# EasyEDA Pro project ProProject_AceStacksRefac_2024-07-15.epro

# Schematic AcestacksV2
Create Date: 2024-04-24; Page Name: P1; Project Name: AceStacksRefac; Schematic Name: Schematic1_1; Update Date: 2024-05-28; Company: EasyEDA.com; Drawn: EasyEDA; Page Size: A4; Part Number: JLCPCB-002; Reviewed: EasyEDA; Version: V0.1
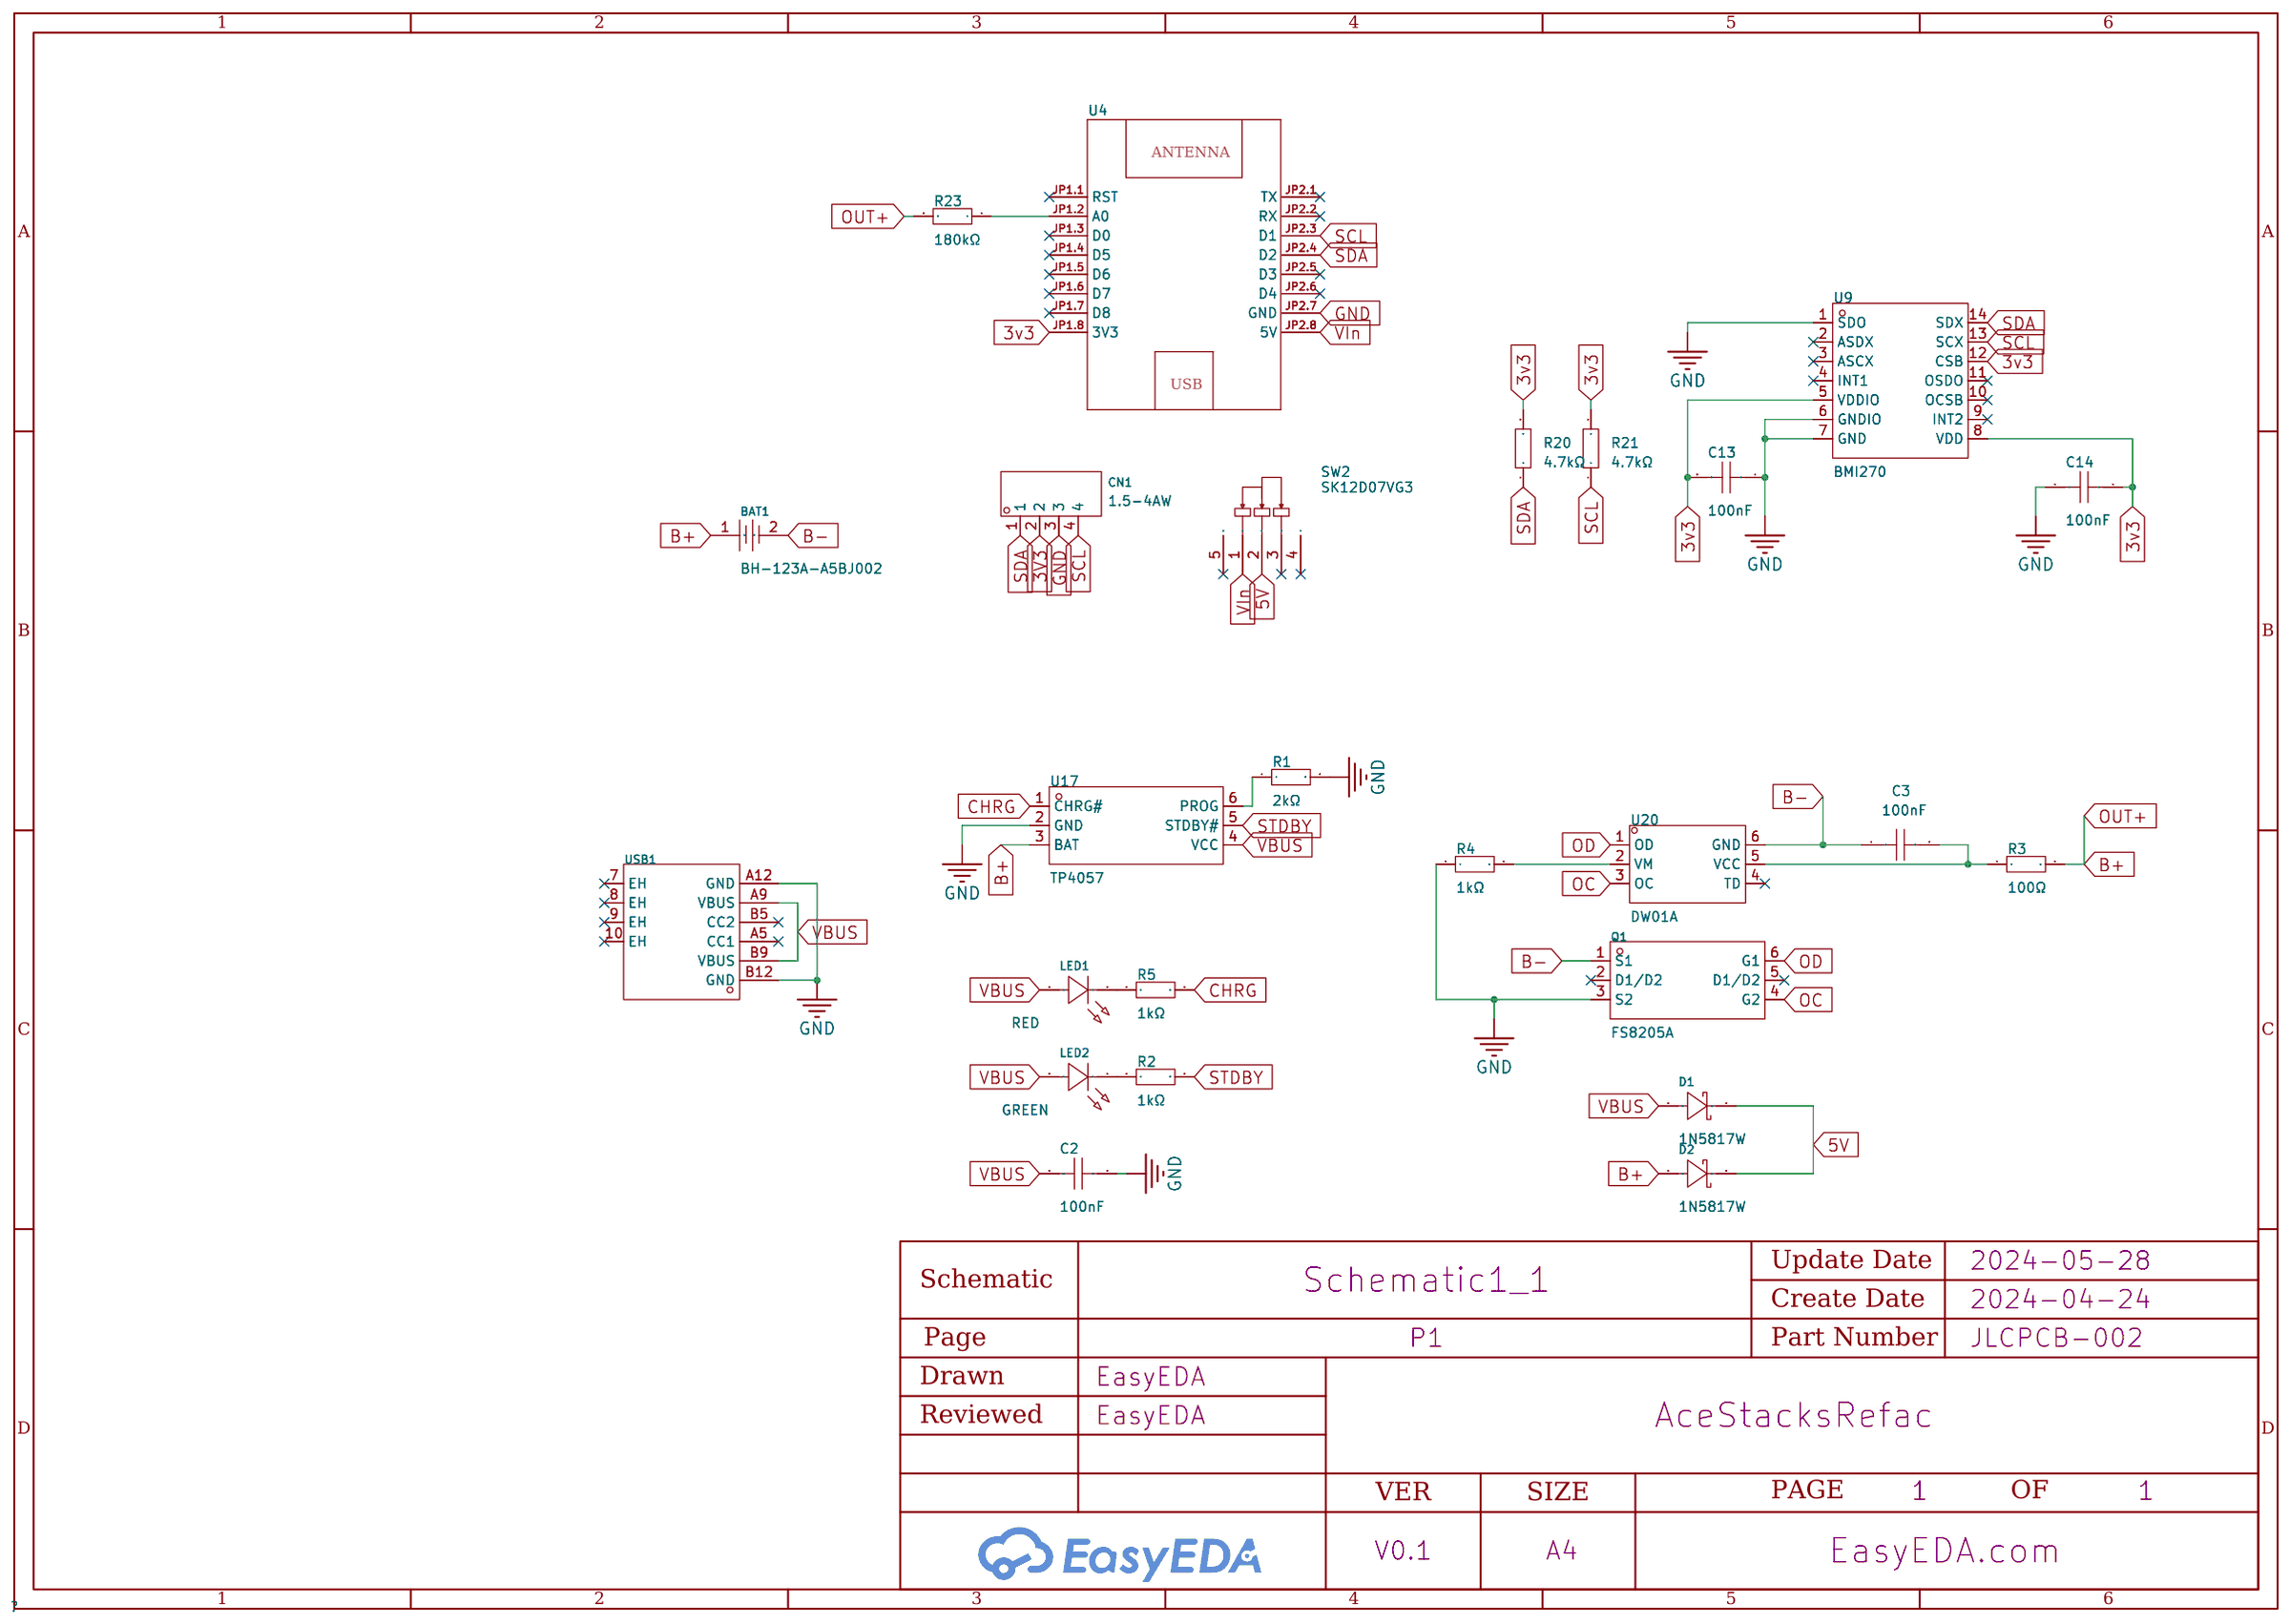
[diagram p0: schematic sheet]

## Parts
BAT1  BH-123A-A5BJ002  [BAT-TH_BH-123A-A5BJ002]
C2  100nF  [C0603]
C3  100nF  [C0603]
C13  100nF  [C0603]
C14  100nF  [C0603]
CN1  1.5-4AW  [CONN-TH_4P-P1.50_ZH1.5-4AW]
D1  1N5817W  [SOD-123_L2.8-W1.8-LS3.7-RD]
D2  1N5817W  [SOD-123_L2.8-W1.8-LS3.7-RD]
LED1  RED  [LED0603-RD_RED]
LED2  GREEN  [LED0603-RD_GREEN]
Q1  FS8205A  [SOT-23-6_L2.9-W1.6-P0.95-LS2.8-BR]
R1  2kΩ  [R0603]
R2  1kΩ  [R0603]
R3  100Ω  [R0603]
R4  1kΩ  [R0603]
R5  1kΩ  [R0603]
R20  4.7kΩ  [R0603]
R21  4.7kΩ  [R0603]
R23  180kΩ  [R0603]
SW2  SK12D07VG3  [SW-TH_SK12D07VG3]
U4  -  [D1-MINI]
U9  BMI270  [LGA-14_L3.0-W2.5-P0.50-BR]
U17  TP4057  [SOT-23-6_L2.9-W1.6-P0.95-LS2.8-BR]
U20  DW01A  [SOT-23-6_L2.9-W1.6-P0.95-LS2.8-BL]
USB1  -  [USB-SMD_U262-061N-4BVC11]

## Library data of the parts
BAT1 = BH-123A-A5BJ002: Connector Type:Battery case Battery Type:CR123A; LCSC Part Name: 电池盒 适用电池:CR123A; Supplier Part: C5290177; Manufacturer: MYOUNG(美阳); JLCPCB Part Class: Extended Part; Datasheet: https://atta.szlcsc.com/upload/public/pdf/source/20221129/C5DF5AE490C9EB9192DFF104AFD36393.pdf; Supplier: LCSC; Connector Type: Battery case; Battery Type: CR123A
C2 C3 C13 C14 = CC0603KRX7R9BB104: Capacitance: Tolerance:±10% Tolerance:±10% Voltage Rated: Temperature Coefficient:; LCSC Part Name: 100nF ±10% 50V; Supplier Part: C14663; Manufacturer: YAGEO(国巨); Supplier Footprint: 0603; JLCPCB Part Class: Basic Part; Datasheet: https://atta.szlcsc.com/upload/public/pdf/source/20180910/C282072_33301C7F631E79921B82A8DAC6BCC5B3.pdf; Supplier: LCSC; Tolerance: ±10%
CN1 = 1.5-4AW_C146006: Pins Structure:1x4P Pitch:1.5mm Mounting Style:Right-Angle Reference Series:ZH Number of Pins:4P Number of Rows:1 Number of PINs Per Row:4 Row Spacing:- Contact Material:-; LCSC Part Name: 1x4P 间距:1.5mm 弯插 系列:ZH; Supplier Part: C146006; Manufacturer: BOOMELE(博穆精密); Supplier Footprint: 弯插,P=1.5mm; JLCPCB Part Class: Extended Part; Datasheet: https://atta.szlcsc.com/upload/public/pdf/source/20180813/C192616_78C4F847BE402CBC7201CF3E488B4D25.pdf; Supplier: LCSC; Pins Structure: 1x4P; Pitch: 1.5mm; Mounting Style: Right-Angle; Reference Series: ZH; Number of Pins: 4P; Number of Rows: 1; Number of PINs Per Row: 4
D1 D2 = 1N5817W: Diode Configuration:Single Forward Voltage (Vf@If):750mV@3A Reverse Voltage (Vr):20V Average Rectified Current (Io):1A Reverse Leakage Current (Ir):1mA@20V; LCSC Part Name: 电压:20V 电流:1A; Supplier Part: C727113; Manufacturer: TWGMC(台湾迪嘉); Supplier Footprint: SOD-123; JLCPCB Part Class: Extended Part; Datasheet: https://atta.szlcsc.com/upload/public/pdf/source/20200828/C727113_260B72EC53C389C21DF1E8AB243F1BFC.pdf; Supplier: LCSC; Diode Configuration: Single; Forward Voltage (Vf@If): 750mV@3A; Reverse Voltage (Vr): 20V; Average Rectified Current (Io): 1A; Reverse Leakage Current (Ir): 1mA@20V
LED1 = XL-1608SURC-06: Emitted Color:Red Power Dissipation:55mW Forward Current:25mA Dominant Wavelength:617nm~621nm Dominant Wavelength:617nm~621nm Peak Wavelength:623nm Lens Color:无色透明透镜 Color Temperature:- Color Temperature:- Viewing Angle:120° Mounting Sytle:Positive post O; Supplier Part: C965799; Manufacturer: XINGLIGHT(成兴光); Supplier Footprint: 0603; JLCPCB Part Class: Extended Part; Datasheet: https://atta.szlcsc.com/upload/public/pdf/source/20221102/D860AFDD1CDB02C5A8064103A32707E2.pdf; Supplier: LCSC; Emitted Color: Red; Power Dissipation: 55mW; Forward Current: 25mA; Dominant Wavelength: 617nm~621nm; Peak Wavelength: 623nm; Lens Color: 无色透明透镜; Viewing Angle: 120°; Mounting Sytle: Positive post; Operating Temperature: -30℃~+85℃
LED2 = XL-1608UGC-04: Lamp Holder Type:- Emitted Color:Emerald Forward Voltage (VF):- Forward Voltage (VF):- Power Dissipation:80mW Forward Current:25mA Dominant Wavelength:516nm~525nm Dominant Wavelength:516nm~525nm Peak Wavelength:534nm Diode Configuration:独立二极管 Lens Color:无; Supplier Part: C965804; Manufacturer: XINGLIGHT(成兴光); Supplier Footprint: 0603; JLCPCB Part Class: Extended Part; Datasheet: https://atta.szlcsc.com/upload/public/pdf/source/20221102/520D6E465E5CFD1609C8A4DBC80D4018.pdf; Supplier: LCSC; Emitted Color: Emerald; Power Dissipation: 80mW; Forward Current: 25mA; Dominant Wavelength: 516nm~525nm; Peak Wavelength: 534nm; Diode Configuration: 独立二极管; Lens Color: 无色透明透镜; Viewing Angle: 120°; Mounting Sytle: Positive post; Operating Temperature: -30℃~+85℃
Q1 = FS8205A_C908265: Type:2 N-Channel Drain Source Voltage (Vdss): Continuous Drain Current (Id): Power Dissipation (Pd): Drain Source On Resistance (RDS(on)@Vgs,Id):18mΩ@4.5V,6A Gate Threshold Voltage (Vgs(th)@Id):1.2V@250uA Total Gate Charge (Qg@Vgs):11nC@4.5V Input Capacit; LCSC Part Name: 2个N沟道 耐压:20V 电流:6A; Supplier Part: C908265; Manufacturer: FUXINSEMI(富芯森美); Supplier Footprint: SOT-23-6L; JLCPCB Part Class: Extended Part; Datasheet: https://atta.szlcsc.com/upload/public/pdf/source/20201027/C908265_C6F1A5E0FB14735EF799FEF607A99450.pdf; Supplier: LCSC; Type: 2 N-Channel; Drain Source On Resistance (RDS(on)@Vgs,Id): 18mΩ@4.5V,6A; Gate Threshold Voltage (Vgs(th)@Id): 1.2V@250uA; Total Gate Charge (Qg@Vgs): 11nC@4.5V; Input Capacitance (Ciss@Vds): 800pF@8V; Reverse Transfer Capacitance (Crss@Vds): 125pF@8V; Operating Temperature: -55℃~+150℃@(Tj)
R1 = 0603WAF2001T5E: Type:Thick Film Resistors Resistance:2kΩ Tolerance:±1% Tolerance:±1% Power(Watts): Overload Voltage (Max): Temperature Coefficient:±100ppm/℃ Temperature Coefficient:±100ppm/℃ Operating Temperature Range:-55℃~+155℃ Operating Temperature Range:-55℃~+155℃; LCSC Part Name: 2kΩ ±1% 100mW 厚膜电阻; Supplier Part: C22975; Manufacturer: UNI-ROYAL(厚声); Supplier Footprint: 0603; JLCPCB Part Class: Basic Part; Datasheet: https://atta.szlcsc.com/upload/public/pdf/source/20200306/C422600_1E6D84923E4A46A82E41ADD87F860B5C.pdf; Supplier: LCSC; Type: Thick Film Resistors; Tolerance: ±1%; Temperature Coefficient: ±100ppm/℃; Operating Temperature Range: -55℃~+155℃
R2 R4 R5 = 0603WAF1001T5E: Type:Thick Film Resistors Resistance:1kΩ Tolerance:±1% Tolerance:±1% Power(Watts): Overload Voltage (Max): Temperature Coefficient:±100ppm/℃ Temperature Coefficient:±100ppm/℃ Operating Temperature Range:-55℃~+155℃ Operating Temperature Range:-55℃~+155℃; LCSC Part Name: 1kΩ ±1% 100mW 厚膜电阻; Supplier Part: C21190; Manufacturer: UNI-ROYAL(厚声); Supplier Footprint: 0603; JLCPCB Part Class: Basic Part; Datasheet: https://atta.szlcsc.com/upload/public/pdf/source/20200306/C422600_1E6D84923E4A46A82E41ADD87F860B5C.pdf; Supplier: LCSC; Type: Thick Film Resistors; Tolerance: ±1%; Temperature Coefficient: ±100ppm/℃; Operating Temperature Range: -55℃~+155℃
R3 = 0603WAF1000T5E: Type:Thick Film Resistors Resistance: Tolerance:±1% Tolerance:±1% Power(Watts): Overload Voltage (Max): Temperature Coefficient:±200ppm/℃ Temperature Coefficient:±200ppm/℃ Operating Temperature Range:-55℃~+155℃ Operating Temperature Range:-55℃~+155℃; LCSC Part Name: 100Ω ±1% 100mW 厚膜电阻; Supplier Part: C22775; Manufacturer: UNI-ROYAL(厚声); Supplier Footprint: 0603; JLCPCB Part Class: Basic Part; Datasheet: https://atta.szlcsc.com/upload/public/pdf/source/20200306/C422600_1E6D84923E4A46A82E41ADD87F860B5C.pdf; Supplier: LCSC; Type: Thick Film Resistors; Tolerance: ±1%; Temperature Coefficient: ±200ppm/℃; Operating Temperature Range: -55℃~+155℃
R20 R21 = 0603WAF4701T5E: Type:Thick Film Resistors Resistance:4.7kΩ Tolerance:±1% Tolerance:±1% Power(Watts): Overload Voltage (Max): Temperature Coefficient:±100ppm/℃ Temperature Coefficient:±100ppm/℃ Operating Temperature Range:-55℃~+155℃ Operating Temperature Range:-55℃~+155℃; LCSC Part Name: 4.7kΩ ±1% 100mW 厚膜电阻; Supplier Part: C23162; Manufacturer: UNI-ROYAL(厚声); Supplier Footprint: 0603; JLCPCB Part Class: Basic Part; Datasheet: https://atta.szlcsc.com/upload/public/pdf/source/20200306/C422600_1E6D84923E4A46A82E41ADD87F860B5C.pdf; Supplier: LCSC; Type: Thick Film Resistors; Tolerance: ±1%; Temperature Coefficient: ±100ppm/℃; Operating Temperature Range: -55℃~+155℃
R23 = RTT03184JTP: Type:Thick Film Resistors Resistance: Tolerance:±5% Tolerance:±5% Power(Watts): Overload Voltage (Max): Temperature Coefficient:±100ppm/℃ Temperature Coefficient:±100ppm/℃ Operating Temperature Range:-55℃~+155℃ Operating Temperature Range:-55℃~+155℃; LCSC Part Name: 厚膜电阻 180kΩ ±5% 100mW; Supplier Part: C103362; Manufacturer: RALEC(旺诠); Supplier Footprint: 0603; JLCPCB Part Class: Extended Part; Datasheet: https://atta.szlcsc.com/upload/public/pdf/source/20191219/C158410_884373A5B7E1BC76BF57BC45A946C093.pdf; Supplier: LCSC; Type: Thick Film Resistors; Tolerance: ±5%; Temperature Coefficient: ±100ppm/℃; Operating Temperature Range: -55℃~+155℃
SW2 = SK12D07VG3_C431547: Circuit:SPDT Actuator Style:- Pin Style:PCPin Switch Length:8.7mm Switch Width:4.4mm Switch Height:4.7mm Mounting Style:侧插 Actuator Color:- Current Rating (DC):500mA Voltage Rating (DC):50V Current Rating (AC):- Voltage Rating (AC):- Mechanical Life:5千次 O; LCSC Part Name: 两档位卧式拨动开关,柄长3MM; Supplier Part: C431547; Manufacturer: SHOU HAN(首韩); Supplier Footprint: 插件; JLCPCB Part Class: Extended Part; Datasheet: https://atta.szlcsc.com/upload/public/pdf/source/20190925/C431547_01B93C6F3FA5C09E15F8CCBF4E6DB91A.pdf; Supplier: LCSC; Circuit: SPDT; Pin Style: PCPin; Switch Length: 8.7mm; Switch Width: 4.4mm; Switch Height: 4.7mm; Mounting Style: 侧插; Current Rating (DC): 500mA; Voltage Rating (DC): 50V; Mechanical Life: 5千次; Operating Temperature: -10℃~+50℃
U4 = D1-MINI
U9 = BMI270: Supplier Part: C2836813; Manufacturer: Bosch(博世); Supplier Footprint: LGA-14(2.5x3); JLCPCB Part Class: Extended Part; Datasheet: https://atta.szlcsc.com/upload/public/pdf/source/20210625/C2836813_35E1F3F92097F45A3828DF13DDBA01A5.pdf; Supplier: LCSC
U17 = TP4057: Supply Voltage:6.5V Supply Voltage:6.5V Maximum Charge Current:500mA Type of Battery:锂离子/Polymer Number of Cells:1 Number of Cells:1 Operating Temperature:-40℃~+85℃ Operating Temperature:-40℃~+85℃; Supplier Part: C725791; Manufacturer: UMW(友台半导体); Supplier Footprint: SOT-23-6; JLCPCB Part Class: Extended Part; Datasheet: https://atta.szlcsc.com/upload/public/pdf/source/20231109/7FB39B0490CD1514A6792371FCA0BB30.pdf; Supplier: LCSC; Supply Voltage: 6.5V; Maximum Charge Current: 500mA; Type of Battery: 锂离子/Polymer; Number of Cells: 1; Operating Temperature: -40℃~+85℃
U20 = DW01A_C351410: Supplier Part: C351410; Manufacturer: PUOLOP(迪浦); Supplier Footprint: SOT-23-6L; JLCPCB Part Class: Extended Part; Datasheet: https://atta.szlcsc.com/upload/public/pdf/source/20190109/C351410_3E9B9491D1909DF24C48D1B9CD871392.pdf; Supplier: LCSC
USB1 = USB_ TYPE-C-6P: Supplier Footprint: Through

## Nets
3v3: C13.2 C14.1 R20.2 R21.2 U4.JP1.8(3V3) U9.5(VDDIO) U9.8(VDD) U9.12(CSB)
3V3: CN1.2
5V: D1.1(C) D2.1(C) SW2.2
GND: C2.1 C13.1 C14.2 CN1.3 Q1.3(S2) R1.2 R4.1 U4.JP2.7(GND) U9.1(SDO) U9.6(GNDIO) U9.7(GND) U17.2(GND) USB1.A12(GND) USB1.B12(GND)
VBUS: C2.2 D1.2(A) LED1.2(A) LED2.2(A) U17.4(VCC) USB1.A9(VBUS) USB1.B9(VBUS)
VIn: SW2.1 U4.JP2.8(5V)
B+: BAT1.1 D2.2(A) R3.2 R23.2 U17.3(BAT)
B-: BAT1.2 C3.1 Q1.1(S1) U20.6(GND)
CHRG: R5.2 U17.1(CHRG#)
OC: Q1.4(G2) U20.3(OC)
OD: Q1.6(G1) U20.1(OD)
SCL: CN1.4 R21.1 U4.JP2.3(D1) U9.13(SCX)
SDA: CN1.1 R20.1 U4.JP2.4(D2) U9.14(SDX)
STDBY: R2.2 U17.5(STDBY#)
$1N2268: C3.2 R3.1 U20.5(VCC)
$1N2333: R1.1 U17.6(PROG)
$1N2700: R4.2 U20.2(VM)
$1N5453: R23.1 U4.JP1.2(A0)
$1N16863: LED1.1(K) R5.1
$1N16996: LED2.1(K) R2.1

Not connected (* = marked no-connect by the designer): Q1 2(D1/D2)* 5(D1/D2)*; SW2 3* 4* 5*; U4 JP1.1(RST)* JP1.3(D0)* JP1.4(D5)* JP1.5(D6)* JP1.6(D7)* JP1.7(D8)* JP2.1(TX)* JP2.2(RX)* JP2.5(D3)* JP2.6(D4)*; U9 2(ASDX)* 3(ASCX)* 4(INT1)* 9(INT2)* 10(OCSB)* 11(OSDO)*; U20 4(TD)*; USB1 7(EH)* 8(EH)* 9(EH)* 10(EH)* A5(CC1)* B5(CC2)*

# Schematic Schematic3
Create Date: 2024-05-04; Page Name: P1; Project Name: AceStacksRefac; Schematic Name: Schematic3; Update Date: 2024-05-28; Company: EasyEDA.com; Drawn: EasyEDA; Page Size: A4; Part Number: JLCPCB-002; Reviewed: EasyEDA; Version: V0.1
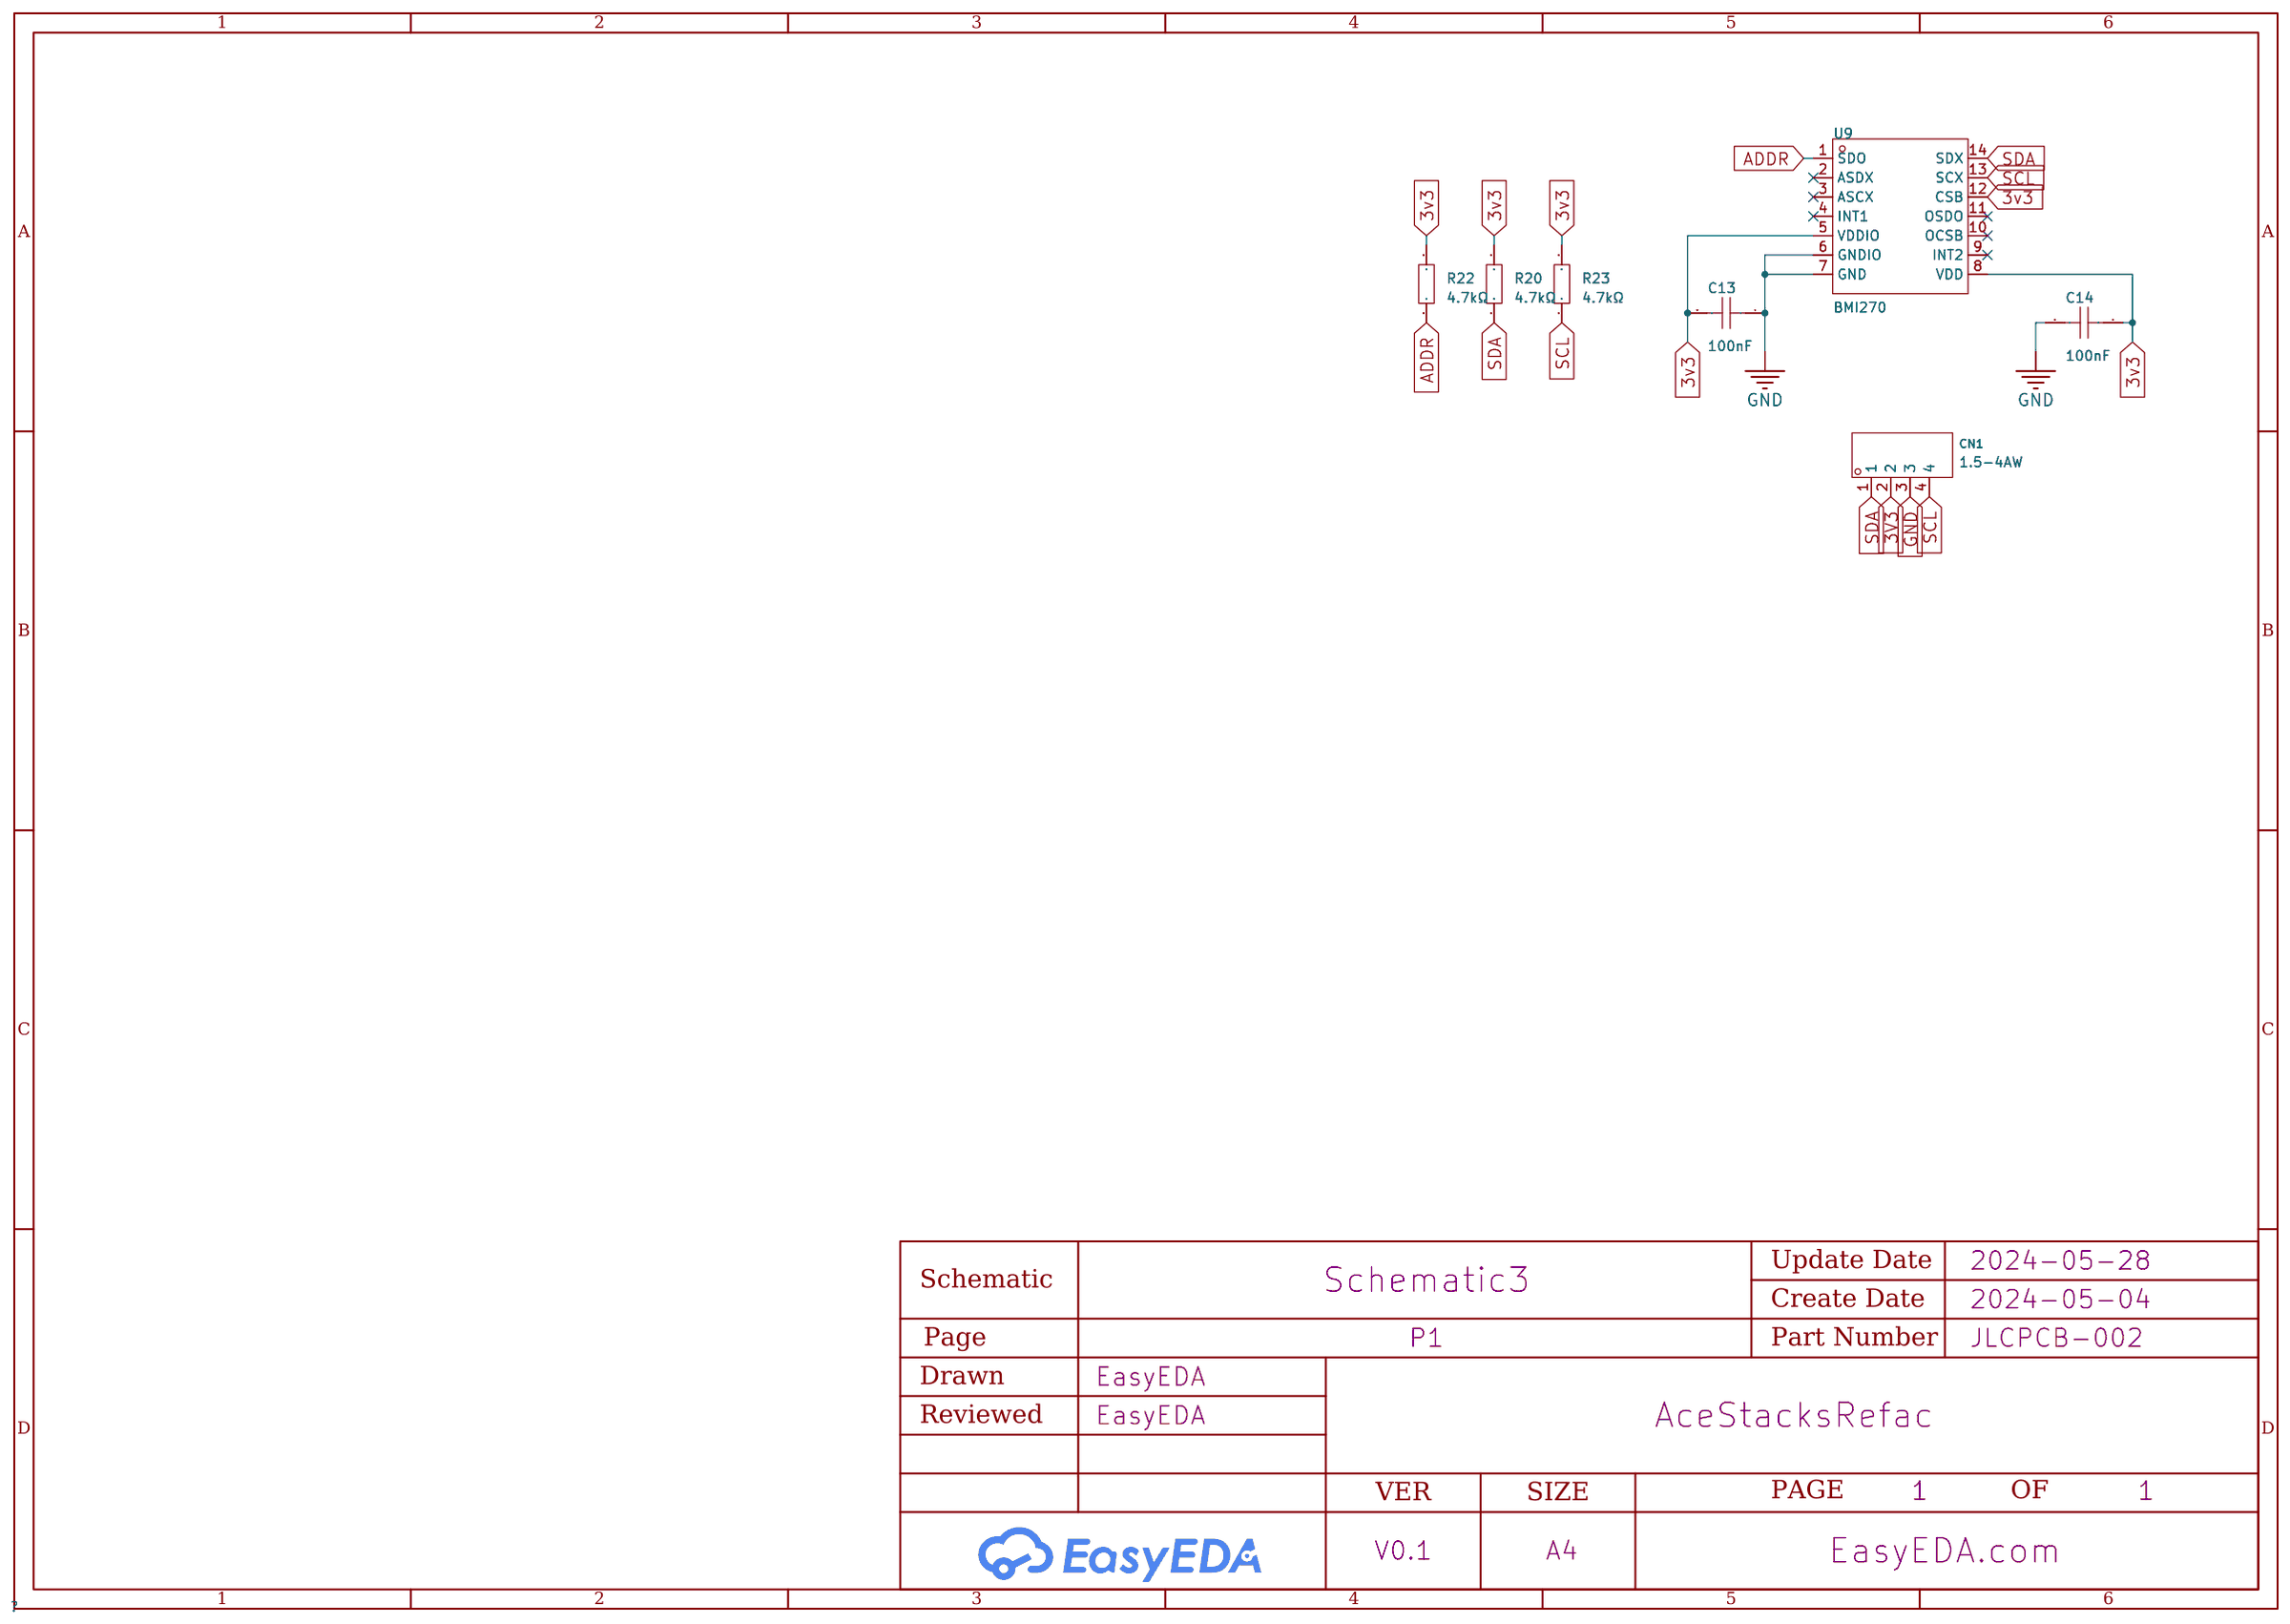
[diagram p1: schematic sheet]

## Parts
C13  100nF  [C0603]
C14  100nF  [C0603]
CN1  1.5-4AW  [CONN-TH_4P-P1.50_ZH1.5-4AW]
R20  4.7kΩ  [R0603]
R22  4.7kΩ  [R0603]
R23  4.7kΩ  [R0603]
U9  BMI270  [LGA-14_L3.0-W2.5-P0.50-BR]

## Library data of the parts
C13 C14 = CC0603KRX7R9BB104: Capacitance: Tolerance:±10% Tolerance:±10% Voltage Rated: Temperature Coefficient:; LCSC Part Name: 100nF ±10% 50V; Supplier Part: C14663; Manufacturer: YAGEO(国巨); Supplier Footprint: 0603; JLCPCB Part Class: Basic Part; Datasheet: https://atta.szlcsc.com/upload/public/pdf/source/20180910/C282072_33301C7F631E79921B82A8DAC6BCC5B3.pdf; Supplier: LCSC; Tolerance: ±10%
CN1 = 1.5-4AW_C146006: Pins Structure:1x4P Pitch:1.5mm Mounting Style:Right-Angle Reference Series:ZH Number of Pins:4P Number of Rows:1 Number of PINs Per Row:4 Row Spacing:- Contact Material:-; LCSC Part Name: 1x4P 间距:1.5mm 弯插 系列:ZH; Supplier Part: C146006; Manufacturer: BOOMELE(博穆精密); Supplier Footprint: 弯插,P=1.5mm; JLCPCB Part Class: Extended Part; Datasheet: https://atta.szlcsc.com/upload/public/pdf/source/20180813/C192616_78C4F847BE402CBC7201CF3E488B4D25.pdf; Supplier: LCSC; Pins Structure: 1x4P; Pitch: 1.5mm; Mounting Style: Right-Angle; Reference Series: ZH; Number of Pins: 4P; Number of Rows: 1; Number of PINs Per Row: 4
R20 R22 R23 = 0603WAF4701T5E: Type:Thick Film Resistors Resistance:4.7kΩ Tolerance:±1% Tolerance:±1% Power(Watts): Overload Voltage (Max): Temperature Coefficient:±100ppm/℃ Temperature Coefficient:±100ppm/℃ Operating Temperature Range:-55℃~+155℃ Operating Temperature Range:-55℃~+155℃; LCSC Part Name: 4.7kΩ ±1% 100mW 厚膜电阻; Supplier Part: C23162; Manufacturer: UNI-ROYAL(厚声); Supplier Footprint: 0603; JLCPCB Part Class: Basic Part; Datasheet: https://atta.szlcsc.com/upload/public/pdf/source/20200306/C422600_1E6D84923E4A46A82E41ADD87F860B5C.pdf; Supplier: LCSC; Type: Thick Film Resistors; Tolerance: ±1%; Temperature Coefficient: ±100ppm/℃; Operating Temperature Range: -55℃~+155℃
U9 = BMI270: Supplier Part: C2836813; Manufacturer: Bosch(博世); Supplier Footprint: LGA-14(2.5x3); JLCPCB Part Class: Extended Part; Datasheet: https://atta.szlcsc.com/upload/public/pdf/source/20210625/C2836813_35E1F3F92097F45A3828DF13DDBA01A5.pdf; Supplier: LCSC

## Nets
3v3: C13.2 C14.1 R20.2 R22.2 R23.2 U9.5(VDDIO) U9.8(VDD) U9.12(CSB)
3V3: CN1.2
GND: C13.1 C14.2 CN1.3 U9.6(GNDIO) U9.7(GND)
ADDR: R22.1 U9.1(SDO)
SCL: CN1.4 R23.1 U9.13(SCX)
SDA: CN1.1 R20.1 U9.14(SDX)

Not connected (* = marked no-connect by the designer): U9 2(ASDX)* 3(ASCX)* 4(INT1)* 9(INT2)* 10(OCSB)* 11(OSDO)*

# Board PCB12
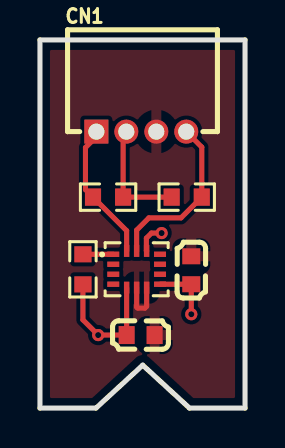
[diagram p2: board, top side]
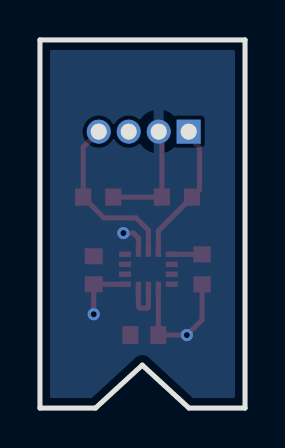
[diagram p3: board, bottom side, seen from below]

Outline 10.26 x 18.44 mm; copper layers: Top Layer, Bottom Layer. Coordinates in mm from the lower left corner of the outline.
Outline path: 0,18.44 0,0 2.8,0 5.14,2.15 7.48,0 10.26,0 10.26,18.44 0,18.44
Stack: Top Layer 0.035mm / Dielectric1 1.51mm FR4 er 4.5 / Bottom Layer 0.035mm

## Design rules (mm)
template: JLCPCB Capability(Two Layers Board)
spacing copperThickness1oz (default): track to track 0.102, other pairs 0.152 to 0.3
spacing copperThickness2oz: track to track 0.203, other pairs 0.152 to 0.3
track width copperThickness1oz (default): min 0.127, default 0.254, max 2.54
track width copperThickness2oz: min 0.203, default 0.254, max 2.54
differential pair differentialPair (default): width min 0.127, default 0.254, max 2.54; gap min 0.152, default 0.152
via viaSize (default): diameter min 0.5, default 0.61, max 10; hole min 0.3, default 0.305, max 6.3

## Placement (name value [footprint] x y rotation side)
C13  100nF  [C0603]  7.57 6.9 270 top
C14  100nF  [C0603]  5.04 3.66 0 top
CN1  1.5-4AW  [CONN-TH_4P-P1.50_ZH1.5-4AW]  5.07 13.84 0 top
R20  4.7kΩ  [R0603]  3.41 10.56 0 top
R22  4.7kΩ  [R0603]  2.15 6.95 270 top
R23  4.7kΩ  [R0603]  7.34 10.56 180 top
U9  BMI270  [LGA-14_L3.0-W2.5-P0.50-BR]  4.84 6.95 180 top

## Footprints (pads in the part's own frame, mm; a bottom-side part is the same pattern mirrored in y, then rotated)
C0603
  rect 0.8x0.9 smd: 1(-0.7,0) 2(0.7,0)
CONN-TH_4P-P1.50_ZH1.5-4AW
  rect 1.2x1.2 hole 0.8: 1(-2.25,0)
  round 1.2 hole 0.8: 2(-0.75,0) 3(0.751,0) 4(2.25,0)
LGA-14_L3.0-W2.5-P0.50-BR
  rect 0.6x0.27 smd: 1(1.17,-0.75) 2(1.17,-0.25) 3(1.17,0.25) 4(1.17,0.75) 8(-1.17,0.75) 9(-1.17,0.25) 10(-1.17,-0.25) 11(-1.17,-0.75)
  rect 0.27x0.6 smd: 5(0.5,0.92) 6(0,0.92) 7(-0.5,0.92) 12(-0.5,-0.92) 13(0,-0.92) 14(0.5,-0.92)
R0603
  rect 0.806x0.864 smd: 1(-0.753,0) 2(0.753,0)

## Nets
As in the schematic, except:
3V3: C13.2 C14.1 CN1.2 R20.2 R22.2 R23.2 U9.5 U9.8 U9.12

Pads without a net: U9 2 3 4 9 10 11

## Via types
v1: diameter 0.61, hole 0.305, Top Layer to Bottom Layer, 3 vias

## Routing (per net, layer and track width the routed paths; a pad name or vN(x,y) marks a point on that pad's centre or on a via; arc(x,y) is an arc through that point)
3V3: length 17
  Top Layer w0.254: U9.12 5.33,7.88 5.33,8.51 5.58,8.76 v1(6.09,8.76) ; U9.5 C14.1 v1(2.91,3.66) 2.15,4.42 R22.2 ; CN1.2 4.16,13.68 R20.2 R23.2 ; v1(7.57,4.7) C13.2 U9.8
GND: length 2.5
  Top Layer w0.254: U9.7 5.34,5.09 5.25,5.01 4.89,5.01 4.84,5.06 U9.6
ADDR: length 1.5
  Top Layer w0.254: U9.1 R22.1
SCL: length 8.6
  Top Layer w0.254: U9.13 4.84,8.91 5.45,9.52 7.06,9.52 R23.1 8.1,13.07 CN1.4
SDA: length 7.2
  Top Layer w0.254: 3.08,13.84 2.28,13.05 2.28,10.94 R20.1 4.34,8.88 U9.14

## Copper pours and planes (outline as drawn; the poured copper is in the pictures)
3V3 on Bottom Layer: -2.42,20.45 13.45,20.45 13.45,-3.81 -2.42,-3.81
GND on Top Layer: 11.68,-1.91 -1.28,-1.91 -1.28,20.07 11.68,20.07

# Board PCB1_1
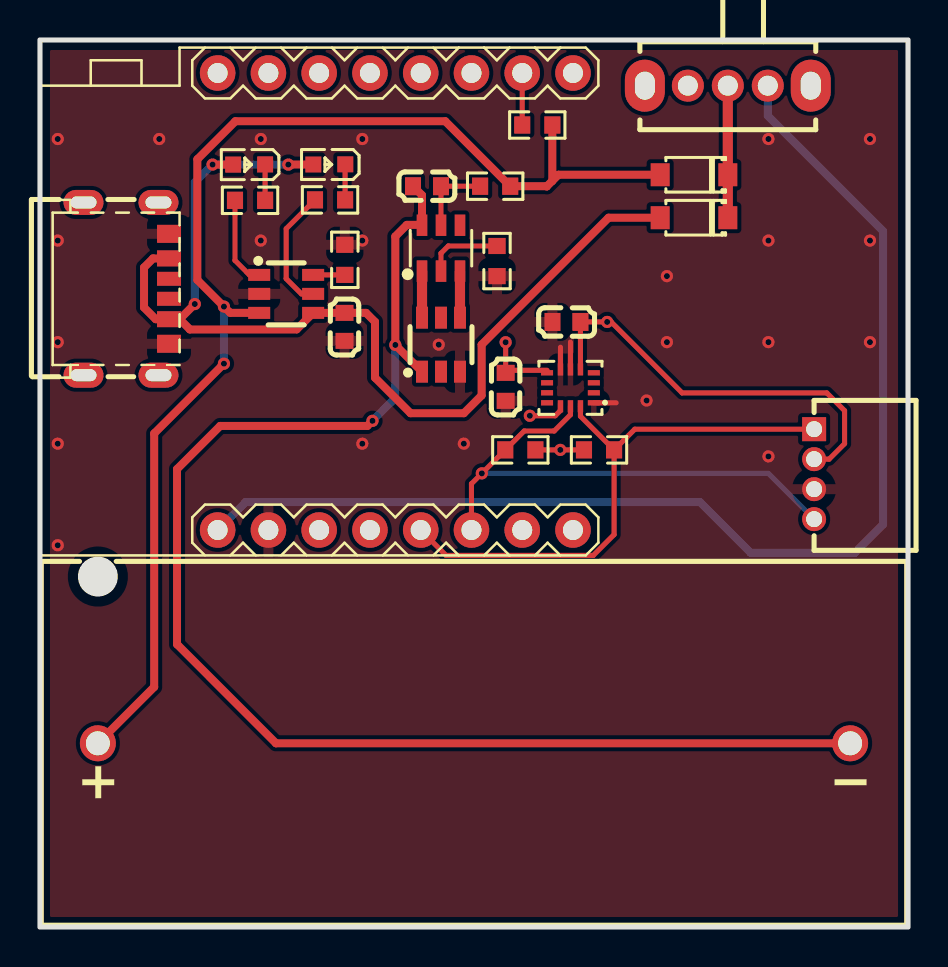
[diagram p4: board, top side]
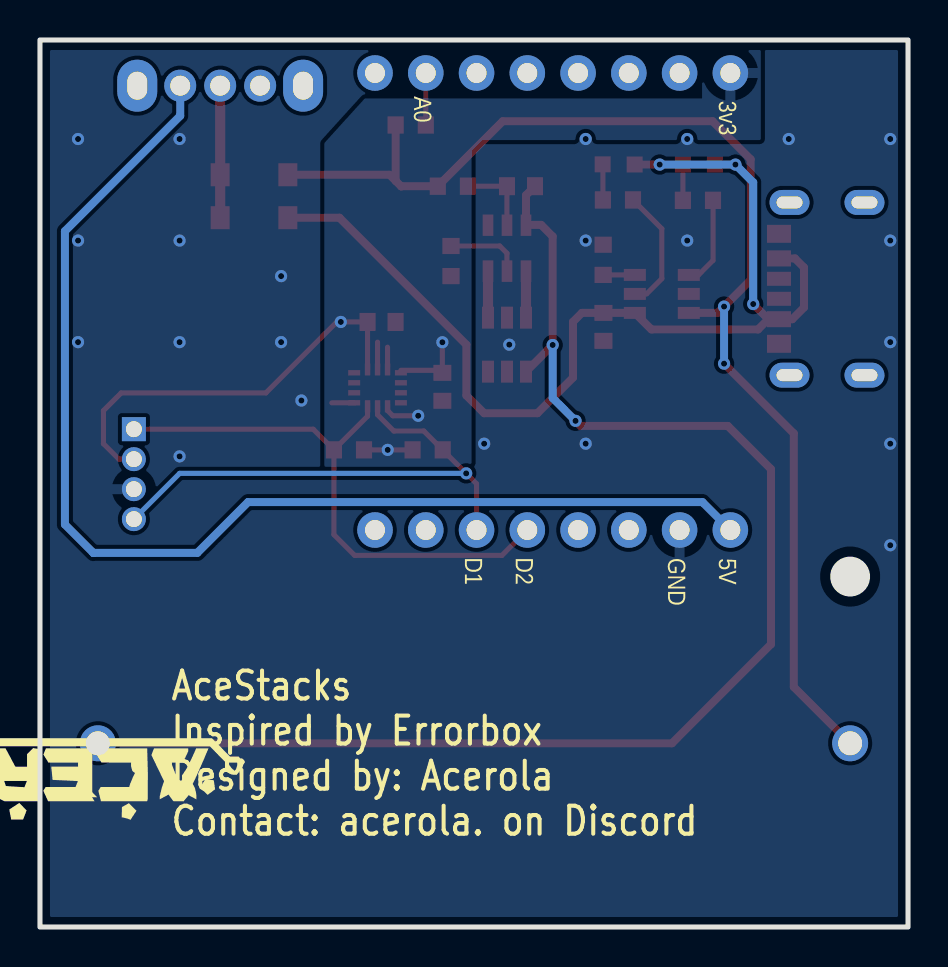
[diagram p5: board, bottom side, seen from below]

Outline 43.43 x 44.37 mm; copper layers: Top Layer, Bottom Layer. Coordinates in mm from the lower left corner of the outline.
Outline path: rectangle 0,44.37 43.43,0
Stack: Top Layer 0.035mm / Dielectric1 1.51mm FR4 er 4.5 / Bottom Layer 0.035mm

## Design rules (mm)
template: Custom Config
spacing copperThickness1oz (default): track to track 0.102, other pairs 0.152 to 0.3
spacing copperThickness2oz: track to track 0.203, other pairs 0.152 to 0.3
track width copperThickness1oz (default): min 0.127, default 0.254, max 2.54
track width copperThickness2oz: min 0.203, default 0.254, max 2.54
differential pair differentialPair (default): width min 0.127, default 0.254, max 2.54; gap min 0.152, default 0.152
via viaSize (default): diameter min 0.5, default 0.61, max 10; hole min 0.3, default 0.305, max 6.299

## Placement (name value [footprint] x y rotation side)
BAT1  BH-123A-A5BJ002  [BAT-TH_BH-123A-A5BJ002]  21.72 9.19 0 top
C2  100nF  [C0603]  15.24 30.02 90 top
C3  100nF  [C0603]  19.37 37.05 0 top
C13  100nF  [C0603]  23.3 27.02 90 top
C14  100nF  [C0603]  26.34 30.27 180 top
CN1  1.5-4AW  [CONN-TH_4P-P1.50_ZH1.5-4AW]  38.73 22.65 270 top
D1  1N5817W  [SOD-123_L2.8-W1.8-LS3.7-RD]  32.72 35.48 180 top
D2  1N5817W  [SOD-123_L2.8-W1.8-LS3.7-RD]  32.72 37.63 180 top
LED1  RED  [LED0603-RD_RED]  10.47 38.14 180 top
LED2  GREEN  [LED0603-RD_GREEN]  14.48 38.15 180 top
Q1  FS8205A  [SOT-23-6_L2.9-W1.6-P0.95-LS2.8-BR]  20.07 29.13 270 top
R1  2kΩ  [R0603]  15.25 33.37 90 top
R2  1kΩ  [R0603]  14.51 36.37 180 top
R3  100Ω  [R0603]  22.78 37.05 0 top
R4  1kΩ  [R0603]  22.87 33.31 90 top
R5  1kΩ  [R0603]  10.51 36.35 180 top
R20  4.7kΩ  [R0603]  27.97 23.87 180 top
R21  4.7kΩ  [R0603]  24.04 23.87 0 top
R23  180kΩ  [R0603]  24.88 40.12 0 top
SW2  SK12D07VG3  [SW-TH_SK12D07VG3]  34.42 42.08 180 top
U4  -  [D1-MINI]  0 43.99 270 top
U9  BMI270  [LGA-14_L3.0-W2.5-P0.50-BR]  26.54 26.97 0 top
U17  TP4057  [SOT-23-6_L2.9-W1.6-P0.95-LS2.8-BR]  12.32 31.67 180 top
U20  DW01A  [SOT-23-6_L2.9-W1.6-P0.95-LS2.8-BL]  20.07 33.95 0 top
USB1  -  [USB-SMD_U262-061N-4BVC11]  4.32 31.92 270 top

## Footprints (pads in the part's own frame, mm; a bottom-side part is the same pattern mirrored in y, then rotated)
BAT-TH_BH-123A-A5BJ002
  round 1.8 hole 1.2: 1(-18.82,0) 2(18.82,0)
C0603
  rect 0.8x0.9 smd: 1(-0.7,0) 2(0.7,0)
CONN-TH_4P-P1.50_ZH1.5-4AW
  rect 1.2x1.2 hole 0.8: 1(-2.25,0)
  round 1.2 hole 0.8: 2(-0.75,0) 3(0.751,0) 4(2.25,0)
D1-MINI
  round 1.778 hole 1.001x1: JP1.1(1.27,26.67) JP1.2(1.27,24.13) JP1.3(1.27,21.59) JP1.4(1.27,19.05) JP1.5(1.27,16.51) JP1.6(1.27,13.97) JP1.7(1.27,11.43) JP1.8(1.27,8.89)
  round 1.778 hole 1x1: JP2.1(24.13,26.67) JP2.2(24.13,24.13) JP2.3(24.13,21.59) JP2.4(24.13,19.05) JP2.5(24.13,16.51) JP2.6(24.13,13.97) JP2.7(24.13,11.43) JP2.8(24.13,8.89)
LED0603-RD_GREEN
  rect 0.8x0.8 smd: 1(-0.799,-0.004) 2(0.799,0.004)
LED0603-RD_RED
  rect 0.8x0.8 smd: 1(-0.799,-0.004) 2(0.799,0.004)
LGA-14_L3.0-W2.5-P0.50-BR
  rect 0.6x0.27 smd: 1(1.17,-0.75) 2(1.17,-0.25) 3(1.17,0.25) 4(1.17,0.75) 8(-1.17,0.75) 9(-1.17,0.25) 10(-1.17,-0.25) 11(-1.17,-0.75)
  rect 0.27x0.6 smd: 5(0.5,0.92) 6(0,0.92) 7(-0.5,0.92) 12(-0.5,-0.92) 13(0,-0.92) 14(0.5,-0.92)
R0603
  rect 0.806x0.864 smd: 1(-0.753,0) 2(0.753,0)
SOD-123_L2.8-W1.8-LS3.7-RD
  rect 0.95x1.15 smd: 1(-1.692,0) 2(1.692,0)
SOT-23-6_L2.9-W1.6-P0.95-LS2.8-BL
  rect 0.532x1.072 smd: 1(-0.95,-1.149) 2(0,-1.149) 3(0.95,-1.149) 4(0.95,1.149) 5(0,1.149) 6(-0.95,1.149)
SOT-23-6_L2.9-W1.6-P0.95-LS2.8-BR
  rect 1.1x0.6 smd: 1(1.35,-0.95) 2(1.35,0) 3(1.35,0.95) 4(-1.35,0.95) 5(-1.35,0) 6(-1.35,-0.95)
SW-TH_SK12D07VG3
  oval 1.6x1.6 hole 1: 1(-2,0) 2(0,0) 3(2,0)
  oval 2x2.6 hole 1x1.4: 4(4.15,0) 5(-4.15,0)
USB-SMD_U262-061N-4BVC11
  oval 1.25x2 hole 0.6x1.3: 7(-4.32,1.611) 8(4.32,1.611) 9(-4.32,-2.139) 10(4.32,-2.139)
  rect 0.7x1.2 smd: A5(-0.5,2.139) B5(0.5,2.139)
  rect 0.8x1.2 smd: A9(1.52,2.139) B9(-1.52,2.139)
  rect 0.9x1.2 smd: A12(2.75,2.139) B12(-2.75,2.139)

## Nets
As in the schematic, except:
3V3: C13.2 C14.1 CN1.2 R20.2 R21.2 U4.JP1.8 U9.5 U9.8 U9.12
VIN: SW2.1 U4.JP2.8
OUT+: BAT1.1 D2.2 R3.2 R23.2 U17.3

Pads without a net: Q1 2 5; SW2 3 4 5; U4 JP1.1 JP1.3 JP1.4 JP1.5 JP1.6 JP1.7 JP2.1 JP2.2 JP2.5 JP2.6; U9 2 3 4 9 10 11; U20 4; USB1 7 8 9 10 A5 B5

## Via types
v1: diameter 0.61, hole 0.305, Top Layer to Bottom Layer, 35 vias

## Routing (per net, layer and track width the routed paths; a pad name or vN(x,y) marks a point on that pad's centre or on a via; arc(x,y) is an arc through that point)
3V3: length 28.8
  Top Layer w0.254: v1(23.3,29.25) 23.3,27.85 25.37,27.85 ; U9.5 C14.1 v1(28.38,30.27) 28.58,30.27 32.13,26.72 39.37,26.72 40.26,25.83 40.26,24.18 39.48,23.4 CN1.2 ; 26.04,26.18 26.04,25.83 25.78,25.57 v1(24.51,25.57) ; R20.2 v1(26.03,23.87) R21.2
5V: length 6.6
  Top Layer w0.508: D1.1 D2.1 SW2.2
GND: length 3.3
  Top Layer w0.254: 26.54,28.02 26.54,29.26 ; 26.04,28.02 26.04,29 ; U9.1 28.83,26.22
  vias: v1(0.89,39.42) v1(0.89,34.34) v1(0.89,29.26) v1(0.89,24.18) v1(0.89,19.1) v1(5.97,39.42) v1(11.05,39.42) v1(11.05,34.34) v1(16.13,39.42) v1(16.13,34.34) v1(16.13,24.18) v1(19.95,29.13) v1(21.21,24.18) v1(30.35,26.33) v1(31.37,32.56) v1(31.37,29.26) v1(36.45,39.42) v1(36.45,34.34) v1(36.45,29.26) v1(36.45,23.54) v1(41.53,39.42) v1(41.53,34.34) v1(41.53,29.26)
VBUS: length 53.7
  Top Layer w0.399: v1(8.64,38.14) 9.55,38.14 9.56,38.15 ; USB1.B9 5.66,33.44 5.21,32.99 5.21,30.99 5.79,30.4 USB1.A9 6.99,30.4 ; 6.99,30.4 7.5,29.89 12.84,29.89 U17.4 C2.2 16.32,30.72 16.76,30.27 16.76,27.48 18.54,25.7 21.21,25.7 22.1,26.59 22.1,29.13 28.45,35.48 D1.2 ; 6.99,30.4 v1(7.75,31.16) ; LED2.2 13.67,38.14 v1(12.43,38.14)
  Bottom Layer w0.399: v1(12.43,38.14) v1(8.64,38.14) 7.75,37.25 v1(7.75,31.16)
VIN: length 59.9
  Bottom Layer w0.399: 8.89,19.86 10.29,21.25 33.02,21.25 35.56,18.71 40.75,18.71 40.76,18.71 42.19,20.13 42.19,34.81 36.42,40.58 SW2.1
B-: length 70.6
  Top Layer w0.399: Q1.1 v1(17.78,29.11) 17.78,34.54 18.36,35.12 19.12,35.12 19.12,36.6 C3.1 ; v1(16.64,25.32) 16.38,25.06 9.02,25.06 6.86,22.91 6.86,14.14 11.81,9.19 BAT1.2
  Bottom Layer w0.399: v1(17.78,29.11) 17.78,26.46 v1(16.64,25.32)
CHRG: length 4.5
  Top Layer w0.254: R5.2 9.76,33.34 10.48,32.62 U17.1
OC: length 2.3
  Top Layer w0.508: U20.3 Q1.4
OD: length 2.3
  Top Layer w0.508: U20.1 Q1.6
OUT+: length 62.6
  Top Layer w0.399: 25.64,37.32 25.94,37.63 D2.2 ; 25.64,37.32 R23.2 ; 25.64,37.32 25.36,37.04 25.35,37.05 R3.2 20.28,40.3 9.78,40.3 7.87,38.4 7.87,32.36 v1(9.21,31.03) 9.52,30.72 U17.3 ; BAT1.1 5.72,12.01 5.72,24.69 v1(9.21,28.18)
  Bottom Layer w0.399: v1(9.21,28.18) v1(9.21,31.03)
SCL: length 26.7
  Top Layer w0.254: 21.59,19.86 21.59,22.17 v1(22.11,22.69) R21.1 24.23,24.81 25.73,24.81 26.54,25.62 U9.13
  Bottom Layer w0.254: v1(22.11,22.69) 36.45,22.69 CN1.4
SDA: length 28.3
  Top Layer w0.254: R20.1 27.04,25.55 U9.14 27.04,26.18 ; R20.1 28.73,19.63 27.69,18.59 20.32,18.59 19.05,19.86 ; R20.1 29.76,24.9 CN1.1
STDBY: length 6.2
  Top Layer w0.254: U17.5 13.08,31.67 12.32,32.43 12.32,34.93 R2.2
$1N2268: length 3.9
  Top Layer w0.254: U20.5 C3.2 R3.1
$1N2333: length 1.6
  Top Layer w0.254: 13.29,32.62 14.87,32.62
$1N2700: length 3.8
  Top Layer w0.254: R4.2 20.43,34.06 20.07,33.7 U20.2
$1N5453: length 2.6
  Top Layer w0.254: R23.1 24.13,42.72
$1N16863: length 1.8
  Top Layer w0.254: R5.1 LED1.1
$1N16996: length 1.8
  Top Layer w0.254: R2.1 15.27,38.14

## Copper pours and planes (outline as drawn; the poured copper is in the pictures)
3V3 on Bottom Layer: 7.37,39.36 21.29,39.36 21.84,38.82 21.84,22.75 29.21,22.75 29.21,39.21 27.18,41.45 10.31,41.45 10.31,43.99 7.36,43.99 7.37,43.98
GND on Top Layer: -11.25,49.76 54.15,49.76 54.15,-7.01 -11.25,-7.01
GND on Bottom Layer: -14.66,52.5 55.66,52.5 55.66,-10.24 -14.66,-10.24

## Text on the board
Bottom Silkscreen Layer: AceStacks / Inspired by Errorbox / Designed by: Acerola / Contact: acerola. on Discord | 5V | 3v3 | GND | D2 | D1 | A0
